# EAGLE design Board_1_controller_v1 (EAGLE 7.1.0)
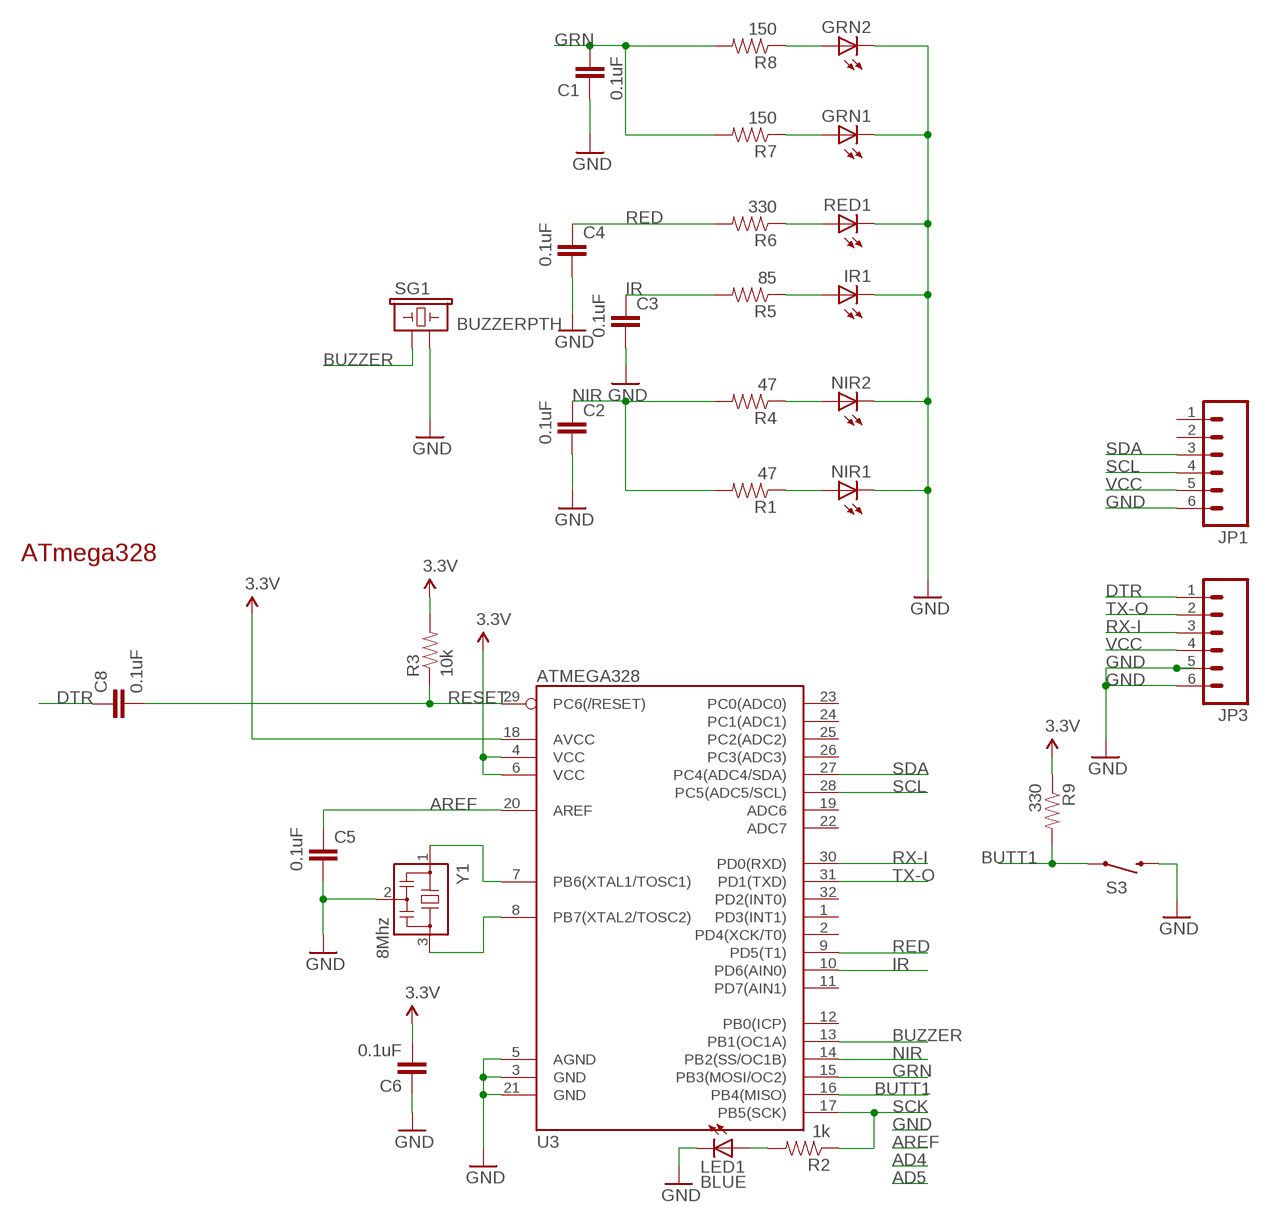
[diagram p0: schematic, sheet 1]

## Parts
C1  0.1uF  CAP0402-CAP  [0402-CAP]
C2  0.1uF  CAP0402-CAP  [0402-CAP]
C3  0.1uF  CAP0402-CAP  [0402-CAP]
C4  0.1uF  CAP0402-CAP  [0402-CAP]
C5  0.1uF  CAP0402-CAP  [0402-CAP]
C6  0.1uF  CAP0402-CAP  [0402-CAP]
C8  0.1uF  CAP0402-CAP  [0402-CAP]
GRN1  LED0603  [LED-0603]
GRN2  LED0603  [LED-0603]
IR1  LED0603  [LED-0603]
JP1  M06SMD-1MM  [1X06-1MM]
JP3  M06SMD-1MM  [1X06-1MM]
LED1  BLUE  LED0603  [LED-0603]
NIR1  LEDLED1550  [1210]
NIR2  LEDLED1550  [1210]
R1  47  RESISTOR0402-RES  [0402-RES]
R2  1k  RESISTOR0402-RES  [0402-RES]
R3  10k  RESISTOR0402-RES  [0402-RES]
R4  47  RESISTOR0402-RES  [0402-RES]
R5  85  RESISTOR0402-RES  [0402-RES]
R6  330  RESISTOR0402-RES  [0402-RES]
R7  150  RESISTOR0402-RES  [0402-RES]
R8  150  RESISTOR0402-RES  [0402-RES]
R9  330  RESISTOR0402-RES  [0402-RES]
RED1  LED0603  [LED-0603]
S3  SWITCH-MOMENTARY-2-SMD-1101NE  [TACTILE-SWITCH-1101NE]
SG1  BUZZERPTH  [BUZZER-12MM]
U3  ATMEGA328  ATMEGA168  [TQFP32-08]
Y1  8Mhz  CSTCR6M00G53Z  [CSTCR6M]

## Nets
AREF: C5.1 U3.20(AREF)
BUTT1: R9.2 S3.P$1 U3.16(PB4(MISO))
BUZZER: SG1.+ U3.13(PB1(OC1A))
DTR: C8.1 JP3.1
GND: C1.1 C2.2 C3.2 C4.2 C5.2 C6.1 GRN1.C GRN2.C IR1.C JP1.6 JP3.5 JP3.6 LED1.C NIR1.2(C) NIR2.2(C) RED1.C S3.P$2 SG1.- U3.3(GND) U3.5(AGND) U3.21(GND) Y1.2
GRN: C1.2 R7.2 R8.2 U3.15(PB3(MOSI/OC2))
IR: C3.1 R5.2 U3.10(PD6(AIN0))
N$1: LED1.A R2.2
N$4: U3.7(PB6(XTAL1/TOSC1)) Y1.1
N$5: U3.8(PB7(XTAL2/TOSC2)) Y1.3
N$6: GRN2.A R8.1
N$9: GRN1.A R7.1
N$11: R6.1 RED1.A
N$13: IR1.A R5.1
N$15: NIR2.1(A) R4.1
N$17: NIR1.1(A) R1.1
NIR: C2.1 R1.2 R4.2 U3.14(PB2(SS/OC1B))
RED: C4.1 R6.2 U3.9(PD5(T1))
RESET: C8.2 R3.1 U3.29(PC6(/RESET))
RX-I: JP3.3 U3.30(PD0(RXD))
SCK: R2.1 U3.17(PB5(SCK))
SCL: JP1.4 U3.28(PC5(ADC5/SCL))
SDA: JP1.3 U3.27(PC4(ADC4/SDA))
TX-O: JP3.2 U3.31(PD1(TXD))
VCC: C6.2 JP1.5 JP3.4 R3.2 R9.1 U3.4(VCC) U3.6(VCC) U3.18(AVCC) ; supply symbol labelled 3.3V
Unconnected: JP1.1 JP1.2 U3.1(PD3(INT1)) U3.2(PD4(XCK/T0)) U3.11(PD7(AIN1)) U3.12(PB0(ICP)) U3.19(ADC6) U3.22(ADC7) U3.23(PC0(ADC0)) U3.24(PC1(ADC1)) U3.25(PC2(ADC2)) U3.26(PC3(ADC3)) U3.32(PD2(INT0))

## Notes on the sheet
- ATmega328

## Library data of the parts
C1-C6 C8 = SparkFun:CAP: Capacitor Standard 0603 ceramic capacitor, and 0.1" leaded capacitor.
GRN1 GRN2 IR1 NIR1 NIR2 RED1 = IdleHandsProject:LED: LEDs Standard schematic elements and footprints for 5mm, 3mm, 1206, and 0603 sized LEDs. 5mm - Spark Fun Electronics SKU : COM-00529 (and others)
JP1 JP3 = SparkFun-Connectors:M06: Header 6 Standard 6-pin 0.1" header. Use with straight break away headers (SKU : PRT-00116), right angle break away headers (PRT-00553), swiss pins (PRT-00743), machine pins (PRT-00117), and female headers (PRT-00115). Molex polarized connector foot print use with SKU : PRT-08094 with associated crimp pins and housings. NOTES ON THE VARIANTS LOCK and LOCK_LONGPADS... This footprint was designed to help hold the alignment of a through-hole component (i.e. 6-pin header) while soldering it into place. You may notice that each hole has been shifted either up or down by 0.005 of an inch from it's more standard position (which is a perfectly straight line). This slight alteration caused the pins (the squares in the middle) to touch the edges of the holes. Because they are alternating, it causes a "brace" to hold the component in place. 0.005 has proven to be the perfect amount of "off-center" position when using our standard breakaway headers. Although looks a little odd when you look at the bare footprint, once you have a header in there, the alteration is very hard to notice. Also,if you push a header all the way into place, it is covered up entirely on the bottom side. This idea of altering the position of holes to aid alignment will be further integrated into the Sparkfun Library for other footprints. It can help hold any component with 3 or more connection pins.
LED1 = SparkFun:LED: LEDs Standard schematic elements and footprints for 5mm, 3mm, 1206, and 0603 sized LEDs. 5mm - Spark Fun Electronics SKU : COM-00529 (and others)
R1-R9 = SparkFun:RESISTOR: Resistor Basic schematic elements and footprints for 0603, 1206, and PTH resistors.
S3 = SparkFun-Electromechanical:SWITCH-MOMENTARY-2: Various NO switches- pushbuttons, reed, etc
SG1 = SparkFun-Electromechanical:BUZZER: Buzzer 12mm Spark Fun Electronics SKU : Comp-Buzzer
U3 = SparkFun:ATMEGA168
Y1 = murata-filter:CSTCR: Resonator Source: murata.co.jp; MPN: CSTCR6M00G53-R0; OC_FARNELL: 1170434; OC_NEWARK: 25M8759

## Net classes
1 vcc: width 0.254 mm

## Board
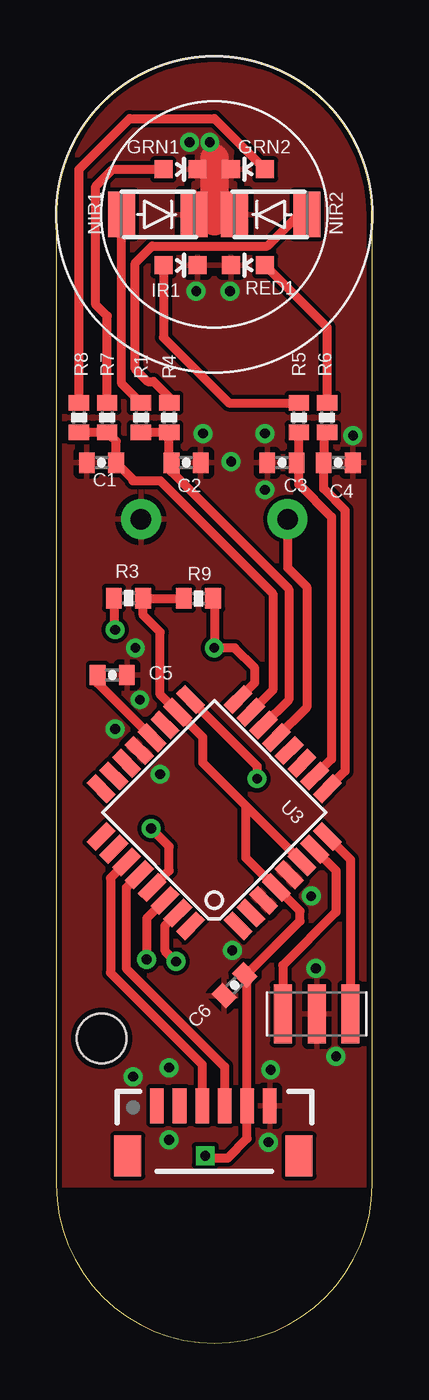
[diagram p1: board, top side]
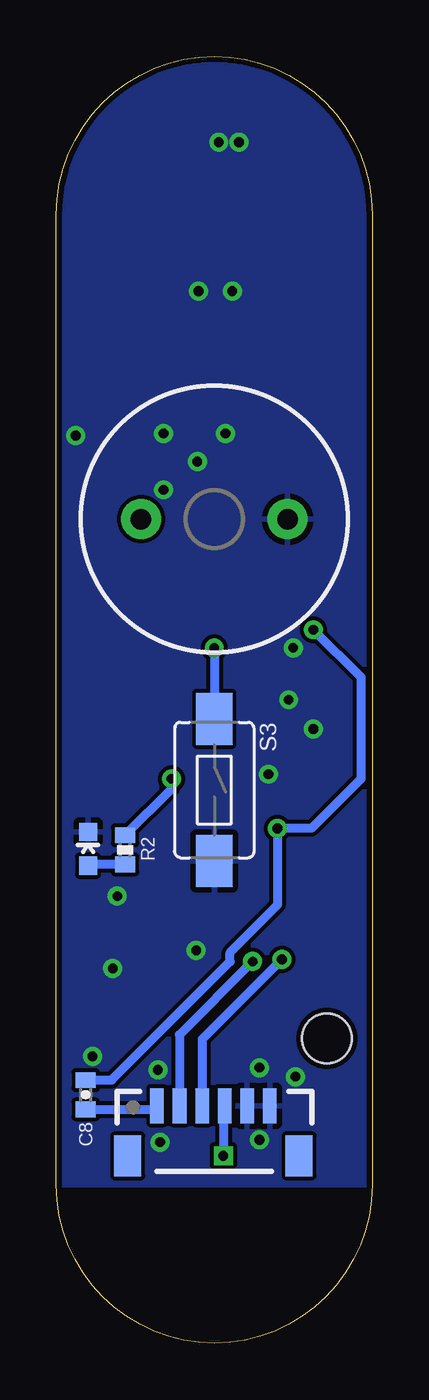
[diagram p2: board, bottom side, seen from below]

Size 14 x 57 mm. Coordinates in mm from the lower left corner, seen from the top.
Outline: 0,7 arc180 14,7 14,50 arc180 0,50 0,7
Copper layers (1*16): Top 0.035mm / dielectric 1.5mm / Bottom 0.035mm
Design rules "default *": minimum track width 10mil, minimum drill 17mil, track to track 7mil, track to pad 7mil, pad to pad 7mil, via to via 7mil, smd to smd 7mil, copper to edge 10mil, drill to drill 8mil, minimum pad ring 10mil, minimum via ring 8mil, stop-mask expansion 4mil, vias tented up to drill 0mil, thermal gap 10mil
Holes 2.2 mm at 2,13.5

### Footprints (pad centres in the part's own frame; a part is rotated, then mirrored left to right if it is on the bottom)
0402-CAP = smd 0.7 x 0.9: 1 -0.65,0; 2 0.65,0
LED-0603 = smd 0.8 x 0.8: A 0,-0.75; C 0,0.75
1X06-1MM = smd 0.6 x 1.55: 1 -2.54,1.27; 2 -1.54,1.27; 3 -0.54,1.27; 4 0.46,1.27; 5 1.46,1.27; 6 2.46,1.27 | smd 1.2 x 1.8: P$1 -3.84,-0.955; P$2 3.76,-0.955
1210 = smd 1.2 x 2: 1 -1.6,0; 2 1.6,0
0402-RES = smd 0.7 x 0.9: 1 -0.65,0; 2 0.65,0
TACTILE-SWITCH-1101NE = smd 2.3 x 1.6: P$1 -3.15,0; P$2 3.15,0
BUZZER-12MM = drill 0.9 pad 1.778: + 3.25,0; - -3.25,0
TQFP32-08 = smd 1.27 x 0.559: 1 -4.293,2.8; 2 -4.293,2; 3 -4.293,1.2; 4 -4.293,0.4; 5 -4.293,-0.4; 6 -4.293,-1.2; 7 -4.293,-2; 8 -4.293,-2.8; 17 4.293,-2.8; 18 4.293,-2; 19 4.293,-1.2; 20 4.293,-0.4; 21 4.293,0.4; 22 4.293,1.2; 23 4.293,2; 24 4.293,2.8 | smd 0.559 x 1.27: 9 -2.8,-4.293; 10 -2,-4.293; 11 -1.2,-4.293; 12 -0.4,-4.293; 13 0.4,-4.293; 14 1.2,-4.293; 15 2,-4.293; 16 2.8,-4.293; 25 2.8,4.293; 26 2,4.293; 27 1.2,4.293; 28 0.4,4.293; 29 -0.4,4.293; 30 -1.2,4.293; 31 -2,4.293; 32 -2.8,4.293
CSTCR6M = smd 0.8 x 2.6: 1 -1.5,0; 2 0,0; 3 1.5,0

### Placement (x,y rotation side)
C1  2,39 0 top
C2  5.75,39 0 top
C3  10,39 180 top
C4  12.5,39 0 top
C5  2.48,29.59 0 top
C6  7.9,15.85 45 top
C8  12.7,11 90 bottom
GRN1  5.5,52 270 top
GRN2  8.5,52 90 top
IR1  5.5,47.75 270 top
JP1  7,9.25 0 top
JP3  7,9.25 0 bottom
LED1  12.6,21.9 0 bottom
NIR1  4.5,50 0 top
NIR2  9.5,50 180 top
R1  3.75,41 270 top
R2  10.95,21.85 270 bottom
R3  3.2,33 0 top
R4  5,41 270 top
R5  10.75,41 270 top
R6  12,41 270 top
R7  2.25,41 270 top
R8  1,41 270 top
R9  6.3,32.99 0 top
RED1  8.5,47.75 90 top
S3  7,24.5 270 bottom
SG1  7,36.5 180 bottom
U3  7,23.5 135 top
Y1  11.54,14.58 0 top

### Tracks (layer width: path | path; a pad name or v marks a point on that pad's centre or on a via)
AREF
  Top 0.406: U3.20 1.83,29.24 C5.1
BUTT1  (via drill 0.43)
  Top 0.406: R9.2 7,32.94 v7,30.8 7.9,30.8 8.8,29.9 8.8,29.26 U3.16
  Bottom 0.406: v7,30.8 S3.P$1
BUZZER
  Top 0.406: SG1.+ 10.25,34.35 11.1,33.5 11.1,28.17 U3.13
DTR
  Bottom 0.406: C8.1 9.71,10.35 JP3.1
GND  (via drill 0.43)
  Top 0.406: GRN1.C 7,52
  Top 1.27: 7,52.5 7,52 7,49.7
  other vias: 6.2,46.6 7.7,46.6 11.3,19.8 7.8,17.4 4.6,25.2 2.6,27.2 3.5,30.8 3.7,28.5 5,12.2 3.4,11.8 5,9 9.4,8.9 9.5,12.1 12.4,12.7 11.5,16.6 6.8,53.2 5.9,53.2 7.75,39.05 6.5,40.3 9.25,37.8 9.25,40.3 13.15,40.2
  pour Top: 0,7 0,50.5 arc-172 14,50.5 14,7
  pour Bottom: 0,7 0,50.5 arc-172 14,50.5 14,7
GRN
  Top 0.406: R8.2 R7.2 | R7.2 2.5,40.1 | U3.15 9.6,28.93 9.6,33.2 4.6,38.2 3.4,38.2 3.4,38.25 C1.2 2.65,39.95 R7.2
IR
  Top 0.406: U3.10 12.2,25.87 12.2,36.6 10.75,38.05 10.75,38.9 | 10.75,38.9 C3.1 | 10.75,38.9 R5.2
N$1
  Bottom 0.406: R2.2 12.55,21.2 LED1.A
N$4
  Top 0.406: U3.7 12.4,20.93 12.4,19.1 10.04,16.74 Y1.1
N$5
  Top 0.406: U3.8 13.04,21.42 Y1.3
N$6
  Top 0.406: R8.1 1,52 3.25,54.25 7,54.25 GRN2.A
N$9
  Top 0.406: R7.1 2.25,45.5 1.75,46 1.75,51.25 2.5,52 GRN1.A
N$11
  Top 0.406: RED1.A 12,45 R6.1
N$13
  Top 0.406: IR1.A 4.75,44.55 7.65,41.65 R5.1
N$15
  Top 0.406: NIR2.1 10.75,50 9.35,48.6 4.25,48.6 3.5,47.85 3.5,43.15 4.05,42.6 4.3,42.6 5,41.9 R4.1
N$17
  Top 0.406: R1.1 2.9,42.5 NIR1.1
NIR
  Top 0.406: R1.2 R4.2 5,38.7 5.1,38.6 | 5.1,38.6 10.3,33.4 10.3,28.5 U3.14 | C2.1 5.1,38.6
RED
  Top 0.406: U3.9 12.8,25.34 12.8,36.9 11.85,37.85 C4.1 11.85,40.2 R6.2
RESET  (via drill 0.43)
  Top 0.406: U3.29 5,20.93 5,22 v4.2,22.8 | R3.1 2.55,31.65 v2.6,31.6
  Bottom 0.406: v2.6,31.6 0.5,29.5 0.5,25 2.7,22.8 v4.2,22.8 4.2,19.4 6.3,17.3 6.3,16.9 11.55,11.65 C8.2
RX-I  (via drill 0.43)
  Top 0.406: U3.30 4,18.8 v4,17
  Bottom 0.406: v4,17 7.54,13.46 JP3.3
SCK  (via drill 0.43)
  Top 0.406: U3.17 8.9,25.56 v8.9,25
  Bottom 0.406: v8.9,25 8.9,24.55 R2.1
SCL
  Top 0.406: U3.28 3.1,20.17 3.1,16.6 7.46,12.24 JP1.4
SDA
  Top 0.406: U3.27 2.4,20.6 2.4,16.4 6.46,12.34 JP1.3
TX-O  (via drill 0.43)
  Top 0.406: U3.31 4.8,18.47 4.8,17.4 v5.3,16.9
  Bottom 0.406: v5.3,16.9 8.54,13.66 JP3.2
VCC  (via drill 0.43)
  Top 0.406: v6.6,8.3 6.7,8.2 7.6,8.2 8.46,9.06 JP1.5 8.46,16.21 C6.2 8.41,16.31 10.8,18.7 10.8,19.13 U3.4 9.72,20.18 8.4,21.5 8.4,23.7 8.45,23.75 | U3.6 9.6,22.6 8.45,23.75 | 8.45,23.75 6.5,25.7 6.5,26.83 U3.18 4.6,28.73 4.6,31.5 3.85,32.25 R3.2 3.86,32.99 R9.1
  Bottom 0.406: JP3.4 6.6,10.46 v6.6,8.3